# EAGLE design REMOTE (EAGLE 9.2.2)
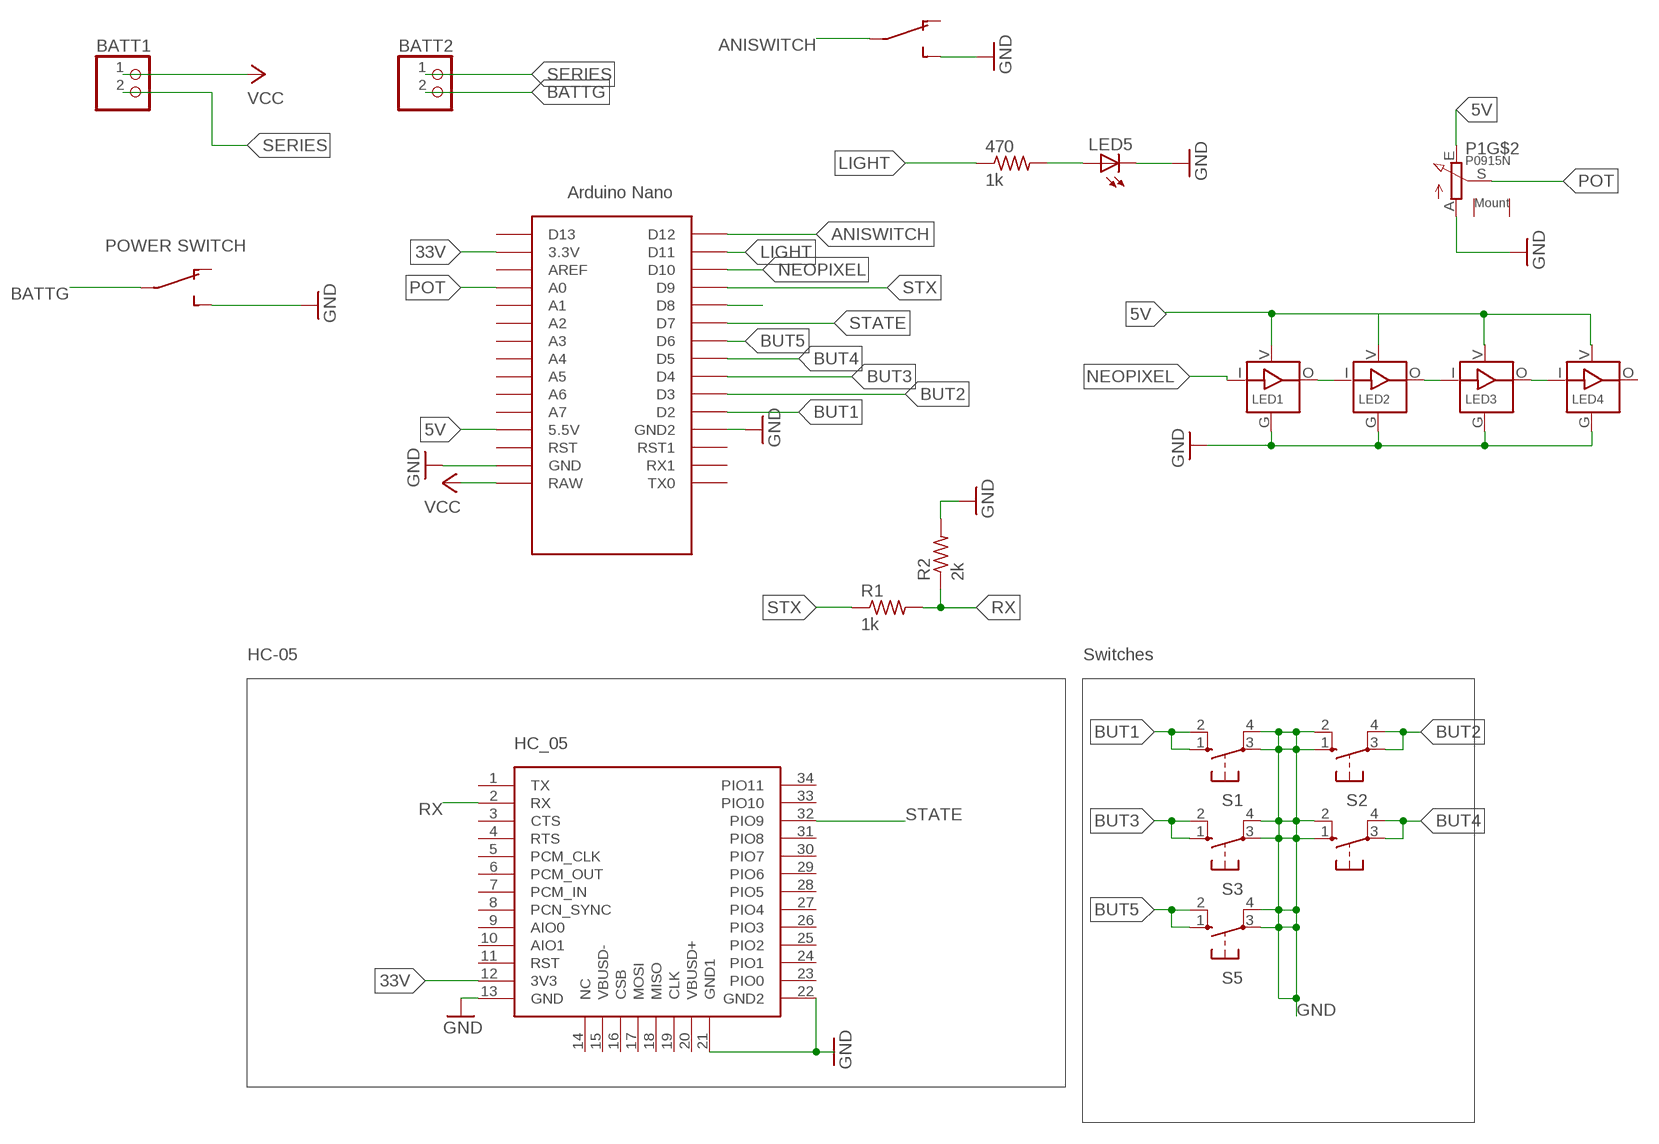
[diagram p0: schematic, sheet 1]

## Parts
470  1k  R-US_R2010  [R2010]
BATT1  PINHD-1X2  [1X02]
BATT2  PINHD-1X2  [1X02]
LED1  SK6812_3535  [LED3535]
LED2  SK6812_3535  [LED3535]
LED3  SK6812_3535  [LED3535]
LED4  SK6812_3535  [LED3535]
LED5  LED3MM  [LED3MM]
P1  P0915N  [P0915N]
POWER  DPDT_JS202011CQN  [DPDT_JS202011CQN]
POWER1  DPDT_JS202011CQN  [DPDT_JS202011CQN]
R1  1k  R-US_R2010  [R2010]
R2  2k  R-US_R2010  [R2010]
S1  10-XX  [B3F-10XX]
S2  10-XX  [B3F-10XX]
S3  10-XX  [B3F-10XX]
S4  10-XX  [B3F-10XX]
S5  10-XX  [B3F-10XX]
U2  HC_05  [BLUETOOTH_SMD]
U$1  NANO  [NANO]

## Nets
5V: LED1.V(VDD) LED2.V(VDD) LED3.V(VDD) LED4.V(VDD) P1.E U$1.5V(5.5V)
33V: U2.12(3V3) U$1.3.3V
ANISWITCH: POWER1.2(A:P) U$1.D12
BATTG: BATT2.2 POWER.2(A:P)
BUT1: S1.1(S) S1.2(S1) U$1.D2
BUT2: S2.3(P) S2.4(P1) U$1.D3
BUT3: S3.1(S) S3.2(S1) U$1.D4
BUT4: S4.3(P) S4.4(P1) U$1.D5
BUT5: S5.1(S) S5.2(S1) U$1.D6
GND: LED1.G(GND) LED2.G(GND) LED3.G(GND) LED4.G(GND) LED5.K(C) P1.A POWER1.3(A:O2) POWER.3(A:O2) R2.2 S1.3(P) S1.4(P1) S2.1(S) S2.2(S1) S3.3(P) S3.4(P1) S4.1(S) S4.2(S1) S5.3(P) S5.4(P1) U2.13(GND) U2.21(GND1) U2.22(GND2) U$1.GND U$1.GND1(GND2)
LIGHT: 470.1 U$1.D11
N$1: U$1.D8
N$2: LED1.O(DO) LED2.I(DI)
N$3: LED2.O(DO) LED3.I(DI)
N$5: LED3.O(DO) LED4.I(DI)
N$7: 470.2 LED5.A
NEOPIXEL: LED1.I(DI) U$1.D10
POT: P1.S U$1.A0
RX: R1.2 R2.1 U2.2(RX)
SERIES: BATT1.2 BATT2.1
STATE: U2.32(PIO9) U$1.D7
STX: R1.1 U$1.D9
VCC: BATT1.1 U$1.RAW
Unconnected: LED4.O(DO) P1.GND@1(GND) P1.GND@2(GND) POWER1.1(A:O1) POWER1.4(B:O1) POWER1.5(B:P) POWER1.6(B:O2) POWER.1(A:O1) POWER.4(B:O1) POWER.5(B:P) POWER.6(B:O2) U2.1(TX) U2.3(CTS) U2.4(RTS) U2.5(PCM_CLK) U2.6(PCM_OUT) U2.7(PCM_IN) U2.8(PCN_SYNC) U2.9(AIO0) U2.10(AIO1) U2.11(RST) U2.14(NC) U2.15(VBUSD-) U2.16(CSB) U2.17(MOSI) U2.18(MISO) U2.19(CLK) U2.20(VBUSD+) U2.23(PIO0) U2.24(PIO1) U2.25(PIO2) U2.26(PIO3) U2.27(PIO4) U2.28(PIO5) U2.29(PIO6) U2.30(PIO7) U2.31(PIO8) U2.33(PIO10) U2.34(PIO11) U$1.A1 U$1.A2 U$1.A3 U$1.A4 U$1.A5 U$1.A6 U$1.A7 U$1.AREF U$1.D13 U$1.ICSP1 U$1.ICSP2 U$1.ICSP3 U$1.ICSP4 U$1.ICSP5 U$1.ICSP6 U$1.RST U$1.RST1 U$1.RX1 U$1.TX0

## Notes on the sheet
- POWER SWITCH
- HC-05 | Switches

## Library data of the parts
470 R1 R2 = adafruit:R-US_: RESISTOR, American symbol
BATT1 BATT2 = pinhead:PINHD-1X2: PIN HEADER
LED1-LED4 = SK6812:SK6812
LED5 = adafruit:LED: LED OSRAM: - CHIPLED LG R971, LG N971, LY N971, LG Q971, LY Q971, LO R971, LY R971 LH N974, LH R974 LS Q976, LO Q976, LY Q976 LO Q996 - Hyper CHIPLED LW Q18S LB Q993, LB Q99A, LB R99A - SideLED LS A670, LO A670, LY A670, LG A670, LP A670 LB A673, LV A673, LT A673, LW A673 LH A674 LY A675 LS A676, LA A676, LO A676, LY A676, LW A676 LS A679, LY A679, LG A679 - Hyper Micro SIDELED® LS Y876, LA Y876, LO Y876, LY Y876 LT Y87S - SmartLED LW L88C, LW L88S LB L89C, LB L89S, LG L890 LS L89K, LO L89K, LY L89K LS L896, LA L896, LO L896, LY L896 - TOPLED LS T670, LO T670, LY T670, LG T670, LP T670 LSG T670, LSP T670, LSY T670, LOP T670, LYG T670 LG T671, LOG T671, LSG T671 LB T673, LV T673, LT T673, LW T673 LH T674 LS T676, LA T676, LO T676, LY T676, LB T676, LH T676, LSB T676, LW T676 LB T67C, LV T67C, LT T67C, LS T67K, LO T67K, LY T67K, LW E67C LS E67B, LA E67B, LO E67B, LY E67B, LB E67C, LV E67C, LT E67C LW T67C LS T679, LY T679, LG T679 LS T770, LO T770, LY T770, LG T770, LP T770 LB T773, LV T773, LT T773, LW T773 LH T774 LS E675, LA E675, LY E675, LS T675 LS T776, LA T776, LO T776, LY T776, LB T776 LHGB T686 LT T68C, LB T68C - Hyper Mini TOPLED® LB M676 - Mini TOPLED Santana® LG M470 LS M47K, LO M47K, LY M47K Source: http://www.osram.convergy.de/
P1 = pot-tt_electronics:P0915N
POWER POWER1 = bt_electromech:DPDT: Dual Position, Dual Throw (DPDT) Switch
S1-S5 = switch-omron:10-XX: OMRON SWITCH; MPN: B3F-1000; OC_FARNELL: 176432; OC_NEWARK: 36M3542
U2 = SerialPortBluetooth:HC_05
U$1 = Arduino-clone:NANO: Arduino Nano

## Board
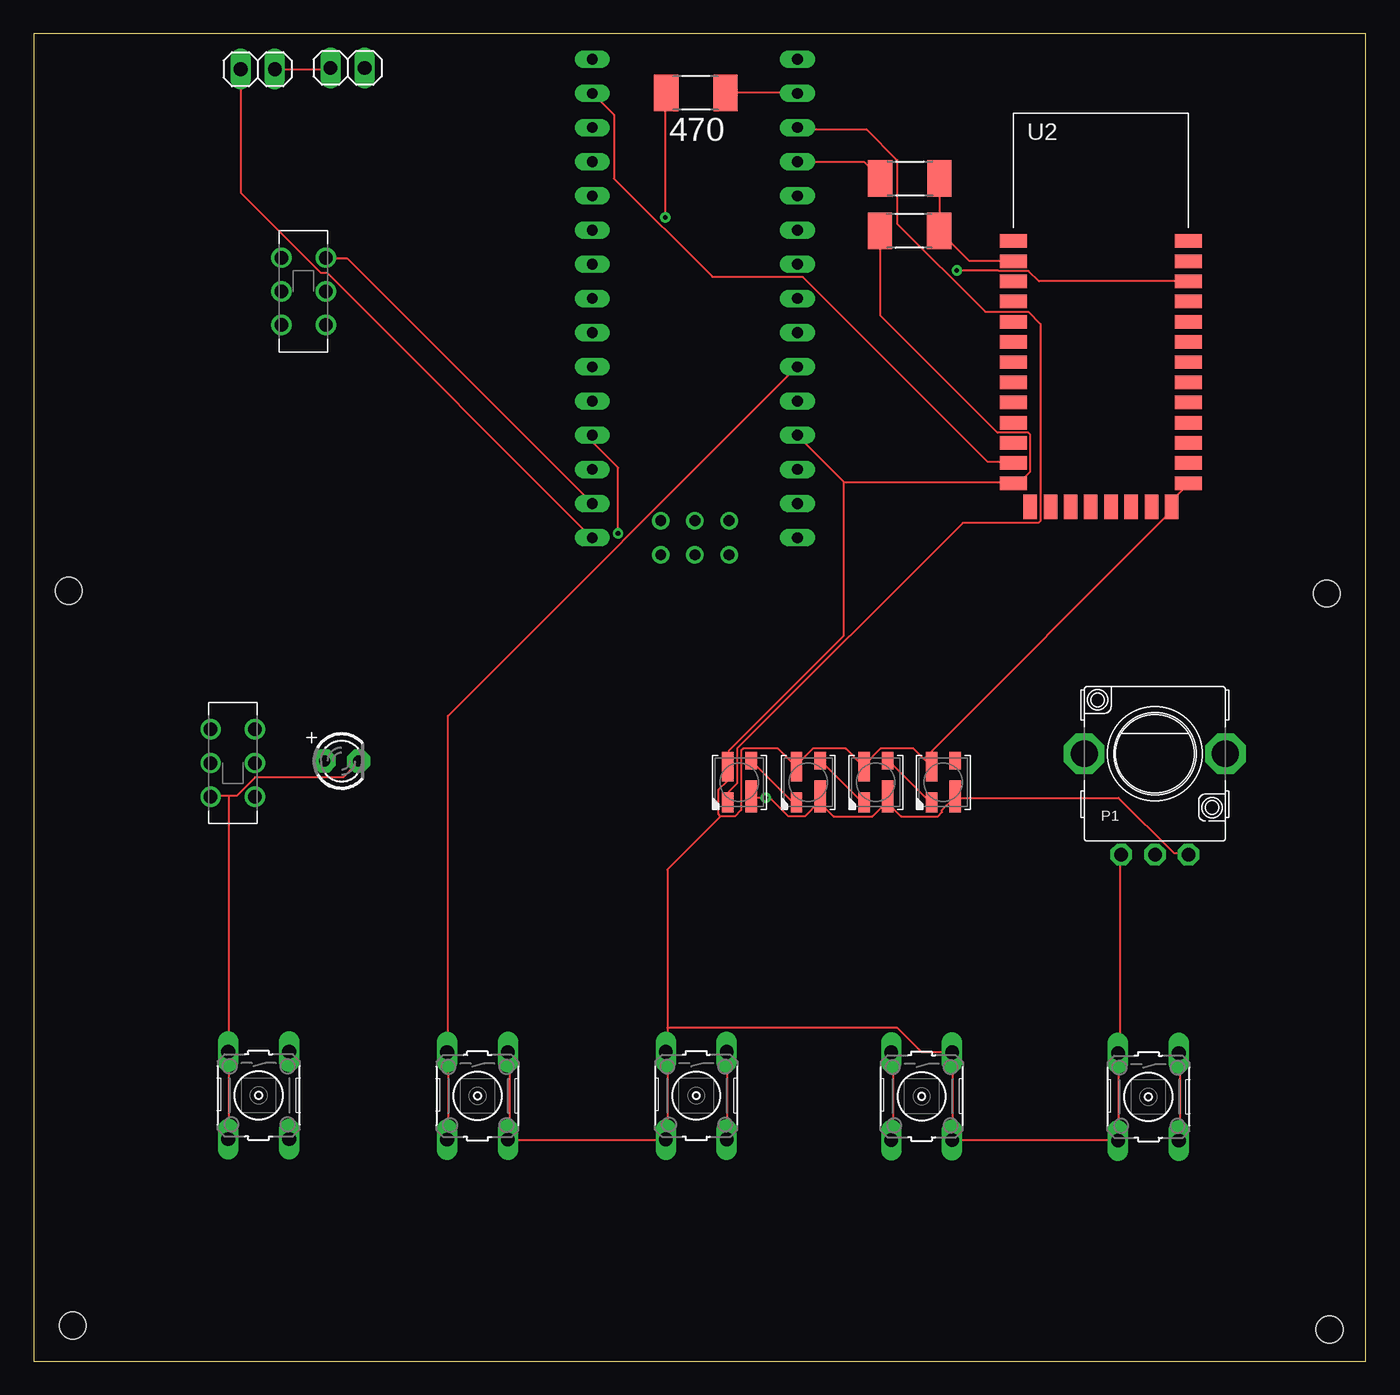
[diagram p1: board, top side]
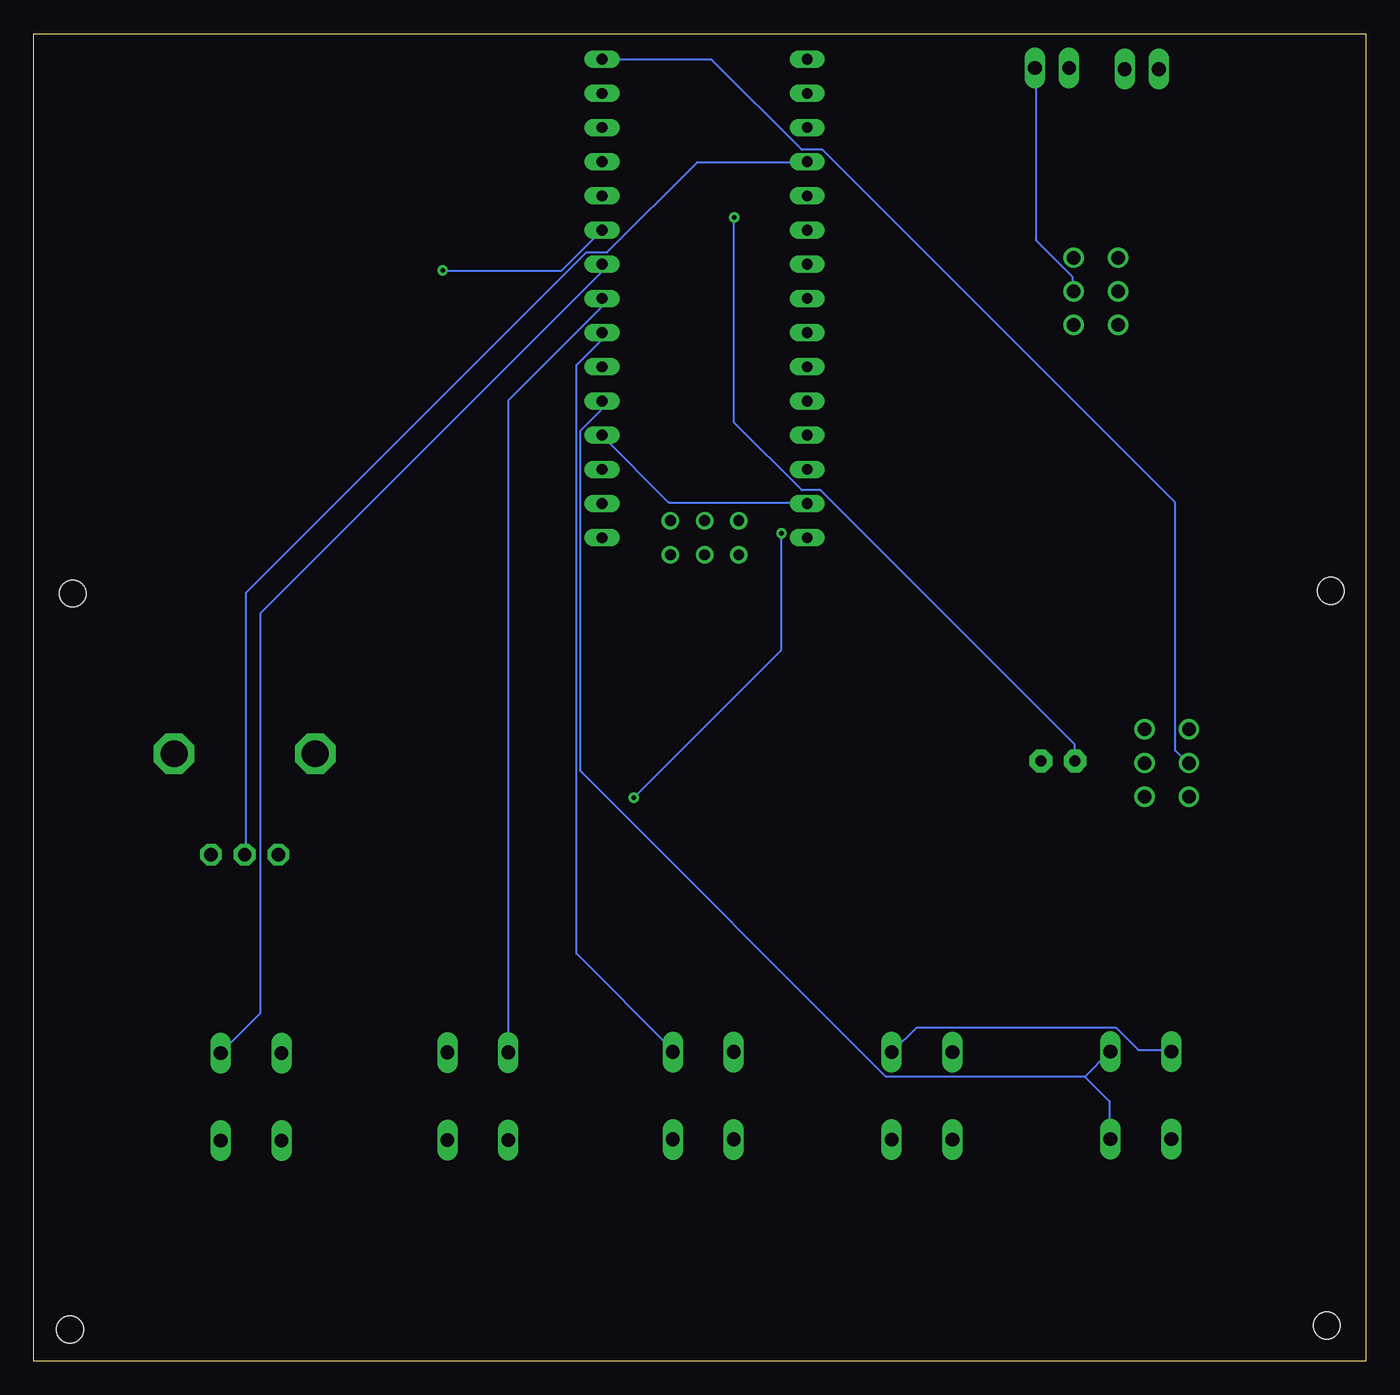
[diagram p2: board, bottom side, seen from below]

Size 99 x 98.66 mm. Coordinates in mm from the lower left corner, seen from the top.
Outline: 99,0 99,98.66 0,98.66 0,0 99,0
Copper layers (1*16): Top 0.035mm / dielectric 1.5mm / Bottom 0.035mm
Design rules "default": minimum track width 6mil, minimum drill 0.35mm, track to track 6mil, track to pad 6mil, pad to pad 6mil, via to via 6mil, smd to smd 6mil, copper to edge 40mil, drill to drill 6mil, minimum pad ring 10mil, minimum via ring 8mil, stop-mask expansion 4mil, vias tented up to drill 0mil, thermal gap 10mil
Holes 2 mm at 2.9,2.66 96.3,2.36 2.6,57.26 96.1,57.06

### Footprints (pad centres in the part's own frame; a part is rotated, then mirrored left to right if it is on the bottom)
R2010 = smd 1.8 x 2.7: 1 -2.2,0; 2 2.2,0
1X02 = drill 1.016 long: 1 -1.27,0; 2 1.27,0
LED3535 = smd 2.2 x 0.85: G 1.15,0.875 | smd 1.5 x 0.85: I -1.5,0.875 | smd 1.3 x 0.85: O 1.6,-0.875 | smd 2.4 x 0.85: V -1.05,-0.875
LED3MM = drill 0.813 pad 1.676 octagon: A -1.27,0; K 1.27,0
P0915N = drill 1 pad 1.6 octagon: A -2.5,-7.5; E 2.5,-7.5; S 0,-7.5 | drill 2 pad 3 octagon: GND@1 -5.25,0; GND@2 5.25,0
DPDT_JS202011CQN = drill 1: 1 -2.5,-1.65; 2 0,-1.651; 3 2.5,-1.65; 4 -2.5,1.65; 5 0,1.651; 6 2.5,1.65
B3F-10XX = drill 1.016 long: 1 -3.251,2.261; 2 3.251,2.261; 3 -3.251,-2.261; 4 3.251,-2.261
BLUETOOTH_SMD = smd 2 x 1: 1 0,0; 2 0,-1.5; 3 0,-3; 4 0,-4.5; 5 0,-6; 6 0,-7.5; 7 0,-9; 8 0,-10.5; 9 0,-12; 10 0,-13.5; 11 0,-15; 12 0,-16.5; 13 0,-18; 22 13,-18; 23 13,-16.5; 24 13,-15; 25 13,-13.5; 26 13,-12; 27 13,-10.5; 28 13,-9; 29 13,-7.5; 30 13,-6; 31 13,-4.5; 32 13,-3; 33 13,-1.5; 34 13,0 | smd 1 x 1.8: 14 1.25,-19.75; 15 2.75,-19.75; 16 4.25,-19.75; 17 5.75,-19.75; 18 7.25,-19.75; 19 8.75,-19.75; 20 10.25,-19.75; 21 11.75,-19.75
NANO = drill 0.8 long: 3.3V -10.16,24.13; 5V -10.16,-1.27; A0 -10.16,19.05; A1 -10.16,16.51; A2 -10.16,13.97; A3 -10.16,11.43; A4 -10.16,8.89; A5 -10.16,6.35; A6 -10.16,3.81; A7 -10.16,1.27; AREF -10.16,21.59; D2 5.08,1.27; D3 5.08,3.81; D4 5.08,6.35; D5 5.08,8.89; D6 5.08,11.43; D7 5.08,13.97; D8 5.08,16.51; D9 5.08,19.05; D10 5.08,21.59; D11 5.08,24.13; D12 5.08,26.67; D13 -10.16,26.67; GND -10.16,-6.35; GND1 5.08,-1.27; RAW -10.16,-8.89; RST -10.16,-3.81; RST1 5.08,-3.81; RX1 5.08,-6.35; TX0 5.08,-8.89 | drill 0.8: ICSP1 -5.08,-10.16; ICSP2 -5.08,-7.62; ICSP3 -2.54,-10.16; ICSP4 -2.54,-7.62; ICSP5 0,-10.16; ICSP6 0,-7.62

### Placement (x,y rotation side)
470  49.21,94.26 180 top
BATT1  16.65,96.02 0 top
BATT2  23.33,96.12 0 top
LED1  52.44,43.02 90 top
LED2  57.56,43.02 90 top
LED3  62.58,43.02 90 top
LED4  67.6,43.02 90 top
LED5  22.88,44.61 0 top
P1  83.32,45.15 0 top
POWER  20.06,79.51 90 top
POWER1  14.8,44.46 270 top
R1  65.11,87.9 0 top
R2  65.09,84 180 top
S1  16.72,19.76 270 top
S2  32.98,19.72 270 top
S3  49.24,19.74 270 top
S4  65.99,19.7 270 top
S5  82.84,19.66 270 top
U2  72.81,83.25 0 top
U$1  51.68,70.09 0 top

### Tracks (layer width: path | path; a pad name or v marks a point on that pad's centre or on a via)
5V  (via drill 0.35)
  Top 0.152: 58.37,41.57 57.3,40.5 56.08,40.5 54.71,41.88 v54.41,41.88 53.34,41.88 LED1.V | 58.37,41.57 58.37,41.88 LED2.V 58.37,41.57 | 63.4,41.57 63.4,41.88 LED3.V 63.4,41.57 | 63.4,41.57 62.33,40.5 59.44,40.5 58.37,41.57 | 63.4,41.57 64.47,40.5 67.21,40.5 67.51,40.81 67.51,40.96 68.43,41.88 LED4.V 68.58,41.88 80.62,41.88 84.73,37.76 85.8,37.76 P1.E | v43.43,61.53 43.43,66.41 41.6,68.24 41.6,68.7 U$1.5V
  Bottom 0.152: v43.43,61.53 43.43,52.85 v54.41,41.88
33V
  Top 0.152: U2.12 72.69,66.87 70.87,66.87 57.15,80.58 50.44,80.58 43.13,87.9 43.13,92.62 41.6,94.15 U$1.3.3V
ANISWITCH
  Bottom 0.152: U$1.D12 56.69,96.74 48.62,96.74 41.91,90.03 40.39,90.03 14.17,63.82 14.17,45.38 13.26,44.47 POWER1.2
BATTG
  Bottom 0.152: POWER.2 21.79,79.52 21.79,80.58 24.54,83.33 24.54,95.98 BATT2.2
BUT1
  Bottom 0.152: 20.88,21.15 35.66,21.15 58.37,43.86 58.37,69.15 56.84,70.68 56.84,71.29 U$1.D2 | 20.88,21.15 19.05,22.98 S1.1 | 20.88,21.15 19.05,19.32 19.05,16.58 S1.2
BUT2
  Top 0.152: U$1.D3 56.69,73.88 30.79,47.97 30.79,22.98 S2.3 30.79,22.82 30.79,16.58 S2.4
BUT3
  Top 0.152: S3.2 51.51,16.58 51.51,22.98 S3.1
  Bottom 0.152: U$1.D4 56.84,76.32 56.84,75.86 58.67,74.03 58.67,30.29 51.51,23.13 S3.1
BUT4
  Top 0.152: S4.4 63.86,16.58 63.86,22.82 S4.3
  Bottom 0.152: U$1.D5 56.84,78.91 56.84,78.3 63.7,71.44 63.7,22.98 S4.3
BUT5
  Top 0.152: S5.2 85.19,16.42 85.19,22.82 S5.1
  Bottom 0.152: U$1.D6 56.84,81.5 56.84,80.89 82.14,55.59 82.14,25.87 85.04,22.98 S5.1
GND
  Top 0.152: 60.2,65.34 72.69,65.34 U2.13 72.85,65.34 73.3,65.34 74.07,66.11 74.07,68.85 73.91,69 71.63,69 62.94,77.69 62.94,83.94 R2.2 | 60.2,65.34 56.84,68.7 U$1.GND1 | POWER.3 21.79,81.96 23.32,81.96 41.45,63.82 U$1.GND | S1.4 14.48,16.58 14.48,22.98 S1.3 14.48,23.13 14.48,42.03 | 14.48,42.03 15.09,42.03 16.46,43.4 23.01,43.4 24.08,44.47 LED5.K | 14.48,42.03 13.26,42.03 POWER1.3 | P1.A 80.77,37.61 80.77,23.13 80.62,22.98 S5.3 80.62,22.82 80.62,16.42 S5.4 80.47,16.42 68.28,16.42 S4.2 68.28,16.58 68.28,22.82 S4.1 68.12,22.98 65.99,22.98 64.16,24.81 47.09,24.81 | S2.1 35.36,22.82 35.36,16.58 S2.2 35.36,16.42 46.94,16.42 S3.4 47.09,16.58 47.09,22.98 S3.3 47.09,23.13 47.09,24.81 | 51.05,40.5 50.9,40.66 50.9,42.48 51.51,43.09 51.51,44.16 LED1.G 51.66,44.31 51.66,45.38 60.2,53.91 60.2,65.34 | 51.05,40.5 52.12,40.5 52.58,40.96 52.58,45.38 52.73,45.53 55.32,45.53 56.54,44.31 LED2.G 56.69,44.31 57.91,45.53 60.35,45.53 61.57,44.31 LED3.G 61.72,44.31 62.94,45.53 65.38,45.53 66.14,44.77 | U2.22 85.8,65.19 84.58,63.97 84.58,63.52 U2.21 84.43,63.36 84.43,63.06 66.14,44.77 | 66.14,44.77 66.6,44.31 LED4.G | 47.09,24.81 47.09,36.54 51.05,40.5
  Bottom 0.152: U$1.GND 41.6,63.82 51.82,63.82 56.69,68.7 U$1.GND1 | S1.3 14.48,23.13 16.92,23.13 18.59,24.81 33.38,24.81 35.2,22.98 S2.1
LIGHT
  Top 0.152: U$1.D11 56.69,94.3 51.51,94.3 470.1
N$2
  Top 0.152: LED1.O 53.34,44.62 56.54,41.42 LED2.I
N$3
  Top 0.152: LED2.O 58.52,44.62 61.57,41.57 LED3.I
N$5
  Top 0.152: LED3.O 63.55,44.62 66.6,41.57 LED4.I
N$7  (via drill 0.35)
  Top 0.152: v46.94,85 46.94,94.15 470.2
  Bottom 0.152: v46.94,85 46.94,69.76 41.91,64.73 40.54,64.73 21.64,45.84 21.64,44.62 LED5.A
NEOPIXEL
  Top 0.152: LED1.I 51.66,41.57 51.66,42.33 52.27,42.94 52.27,45.53 69.04,62.3 74.68,62.3 74.83,62.45 74.83,77.08 73.91,77.99 70.71,77.99 64.16,84.55 64.16,89.27 61.87,91.56 56.84,91.56 U$1.D10
POT
  Bottom 0.152: U$1.A0 41.6,89.12 49.68,89.12 56.39,82.41 57.91,82.41 83.21,57.11 83.21,37.76 P1.S
RX
  Top 0.152: U2.2 72.69,81.8 69.49,81.8 67.36,83.94 R2.1 67.36,84.09 67.36,87.9 R1.2
SERIES
  Top 0.152: BATT1.2 17.98,95.98 21.95,95.98 BATT2.1
STATE  (via drill 0.35)
  Top 0.152: U2.32 74.71,80.25 73.94,81.02 71.72,81.02 71.68,81.06 v68.6,81.06
  Bottom 0.152: v68.6,81.06 59.76,81.06 U$1.D7
STX
  Top 0.152: U$1.D9 56.84,89.12 61.72,89.12 62.79,88.05 R1.1
VCC
  Top 0.152: U$1.RAW 41.45,61.23 21.79,80.89 21.34,80.89 15.39,86.83 15.39,95.98 BATT1.1

### Text on the board
tPlace: 470